# EAGLE schematic BFA_sch (EAGLE 7.6.0)
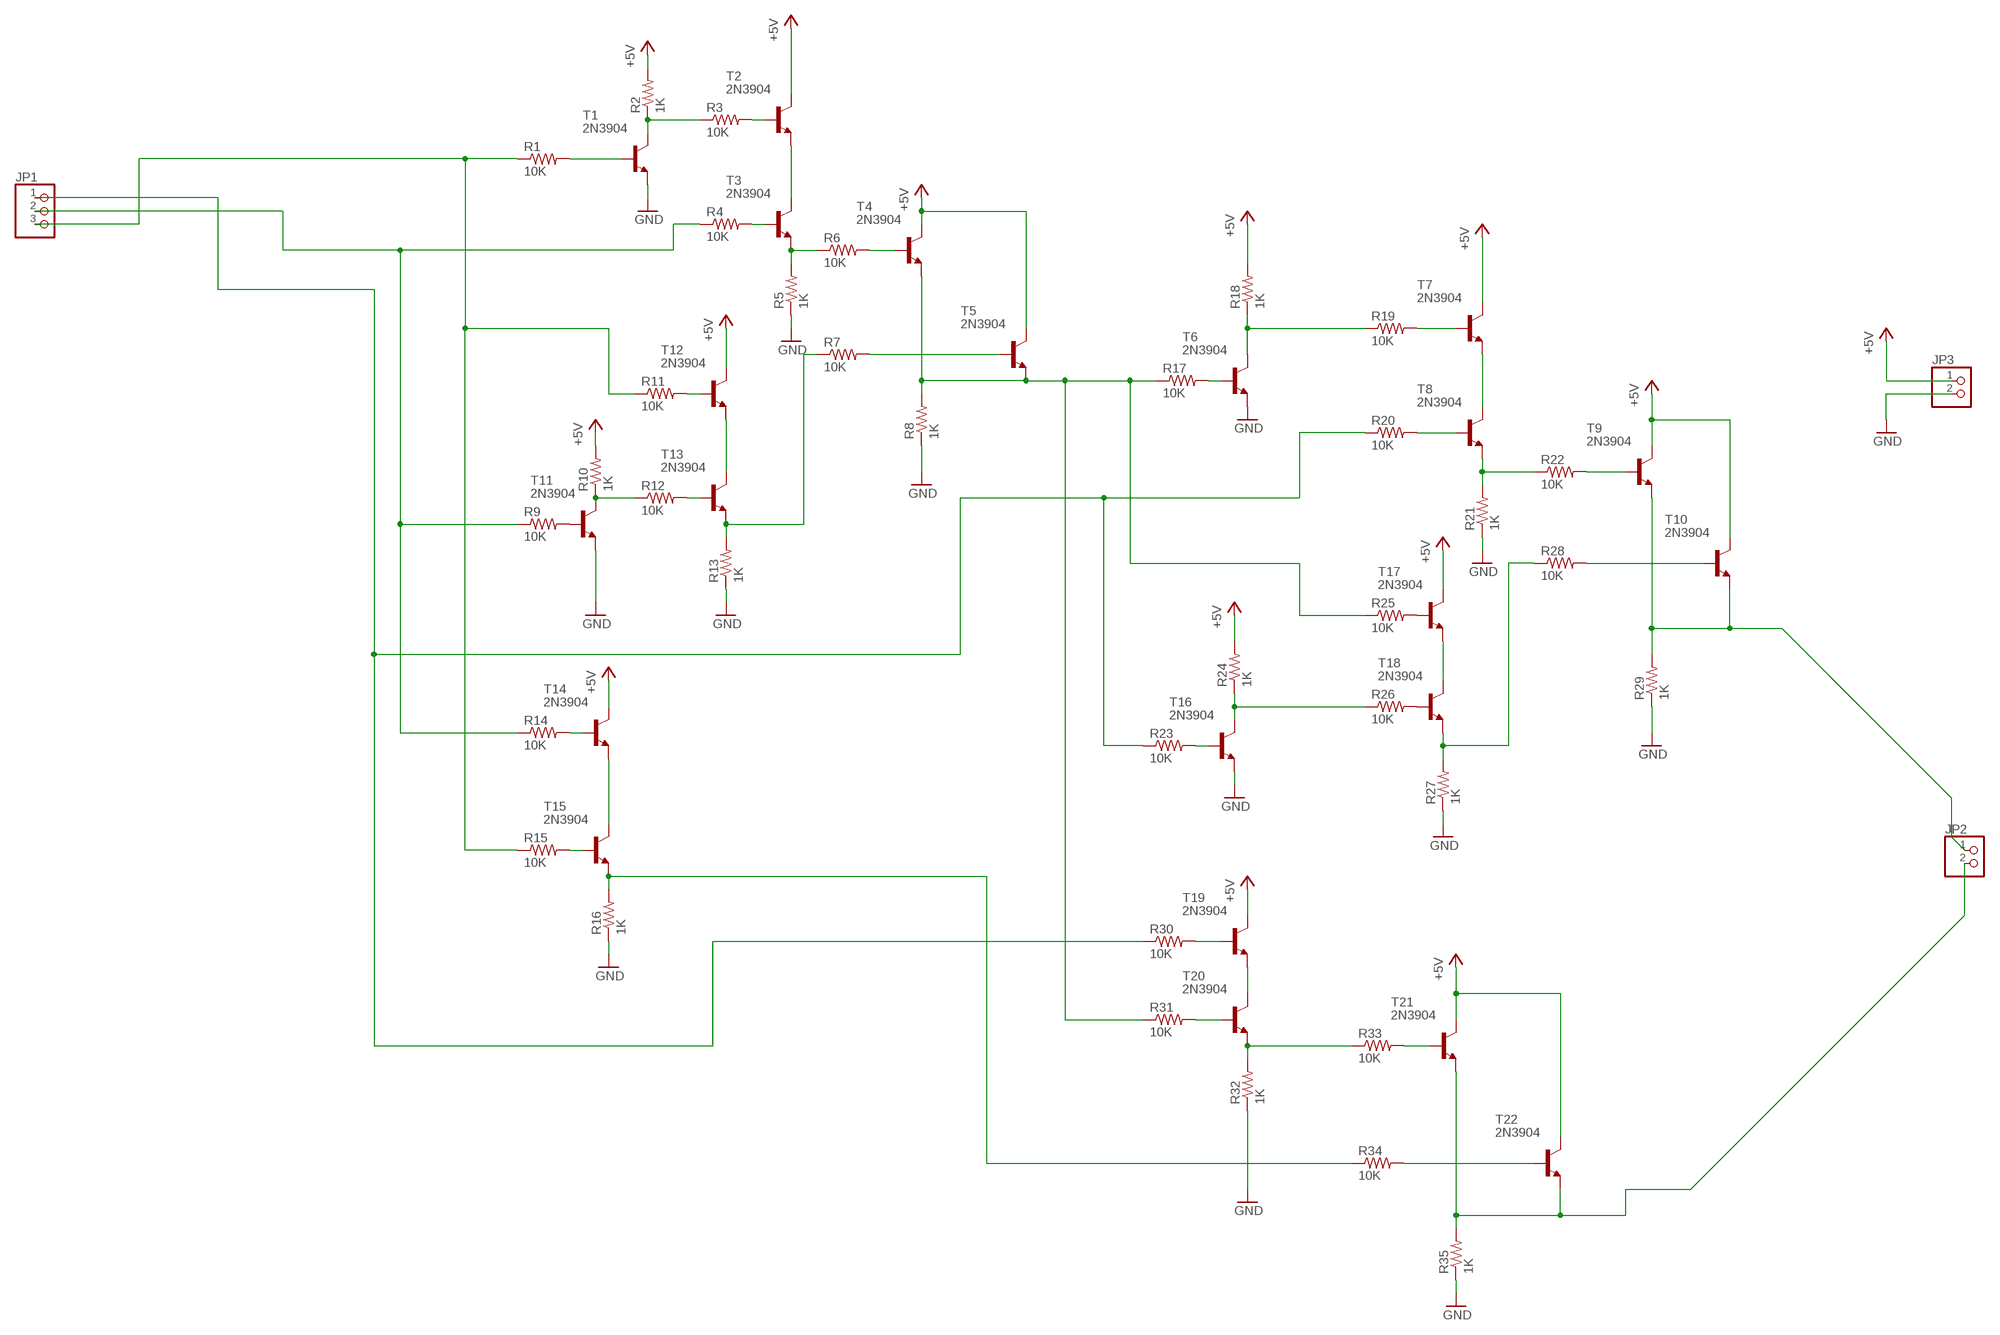
[diagram p0: schematic, sheet 1]

## Parts
JP1  PINHD-1X3/90  [1X03/90]
JP2  PINHD-1X2/90  [1X02/90]
JP3  PINHD-1X2/90  [1X02/90]
R1  10K  R-US_0204/7  [0204/7]
R2  1K  R-US_0204/7  [0204/7]
R3  10K  R-US_0204/7  [0204/7]
R4  10K  R-US_0204/7  [0204/7]
R5  1K  R-US_0204/7  [0204/7]
R6  10K  R-US_0204/7  [0204/7]
R7  10K  R-US_0204/7  [0204/7]
R8  1K  R-US_0204/7  [0204/7]
R9  10K  R-US_0204/7  [0204/7]
R10  1K  R-US_0204/7  [0204/7]
R11  10K  R-US_0204/7  [0204/7]
R12  10K  R-US_0204/7  [0204/7]
R13  1K  R-US_0204/7  [0204/7]
R14  10K  R-US_0204/7  [0204/7]
R15  10K  R-US_0204/7  [0204/7]
R16  1K  R-US_0204/7  [0204/7]
R17  10K  R-US_0204/7  [0204/7]
R18  1K  R-US_0204/7  [0204/7]
R19  10K  R-US_0204/7  [0204/7]
R20  10K  R-US_0204/7  [0204/7]
R21  1K  R-US_0204/7  [0204/7]
R22  10K  R-US_0204/7  [0204/7]
R23  10K  R-US_0204/7  [0204/7]
R24  1K  R-US_0204/7  [0204/7]
R25  10K  R-US_0204/7  [0204/7]
R26  10K  R-US_0204/7  [0204/7]
R27  1K  R-US_0204/7  [0204/7]
R28  10K  R-US_0204/7  [0204/7]
R29  1K  R-US_0204/7  [0204/7]
R30  10K  R-US_0204/7  [0204/7]
R31  10K  R-US_0204/7  [0204/7]
R32  1K  R-US_0204/7  [0204/7]
R33  10K  R-US_0204/7  [0204/7]
R34  10K  R-US_0204/7  [0204/7]
R35  1K  R-US_0204/7  [0204/7]
T1  2N3904  [TO92]
T2  2N3904  [TO92]
T3  2N3904  [TO92]
T4  2N3904  [TO92]
T5  2N3904  [TO92]
T6  2N3904  [TO92]
T7  2N3904  [TO92]
T8  2N3904  [TO92]
T9  2N3904  [TO92]
T10  2N3904  [TO92]
T11  2N3904  [TO92]
T12  2N3904  [TO92]
T13  2N3904  [TO92]
T14  2N3904  [TO92]
T15  2N3904  [TO92]
T16  2N3904  [TO92]
T17  2N3904  [TO92]
T18  2N3904  [TO92]
T19  2N3904  [TO92]
T20  2N3904  [TO92]
T21  2N3904  [TO92]
T22  2N3904  [TO92]

## Nets
+5V: JP3.1 R2.2 R10.2 R18.2 R24.2 T2.1(C) T4.1(C) T5.1(C) T7.1(C) T9.1(C) T10.1(C) T12.1(C) T14.1(C) T17.1(C) T19.1(C) T21.1(C) T22.1(C)
GND: JP3.2 R5.1 R8.1 R13.1 R16.1 R21.1 R27.1 R29.1 R32.1 R35.1 T1.3(E) T6.3(E) T11.3(E) T16.3(E)
N$1: T14.3(E) T15.1(C)
N$2: R9.2 T11.2(B)
N$3: R10.1 R12.1 T11.1(C)
N$4: R5.2 R6.1 T3.3(E)
N$5: T2.3(E) T3.1(C)
N$6: R2.1 R3.1 T1.1(C)
N$7: R19.2 T7.2(B)
N$8: T19.3(E) T20.1(C)
N$9: R32.2 R33.1 T20.3(E)
N$10: JP2.2 R35.2 T21.3(E) T22.3(E)
N$11: R27.2 R28.1 T18.3(E)
N$12: T17.3(E) T18.1(C)
N$13: JP2.1 R29.2 T9.3(E) T10.3(E)
N$14: R21.2 R22.1 T8.3(E)
N$15: T7.3(E) T8.1(C)
N$16: R16.2 R34.1 T15.3(E)
N$17: T12.3(E) T13.1(C)
N$18: R18.1 R19.1 T6.1(C)
N$19: R24.1 R26.1 T16.1(C)
N$20: R7.2 T5.2(B)
N$21: R1.2 T1.2(B)
N$22: JP1.2 R4.1 R9.1 R14.1
N$23: R3.2 T2.2(B)
N$24: R4.2 T3.2(B)
N$25: R6.2 T4.2(B)
N$26: JP1.3 R1.1 R11.1 R15.1
N$27: R11.2 T12.2(B)
N$28: R7.1 R13.2 T13.3(E)
N$29: R8.2 R17.1 R25.1 R31.1 T4.3(E) T5.3(E)
N$30: R25.2 T17.2(B)
N$31: R26.2 T18.2(B)
N$32: R17.2 T6.2(B)
N$33: R15.2 T15.2(B)
N$34: R12.2 T13.2(B)
N$35: R14.2 T14.2(B)
N$36: JP1.1 R20.1 R23.1 R30.1
N$37: R30.2 T19.2(B)
N$38: R31.2 T20.2(B)
N$39: R20.2 T8.2(B)
N$40: R34.2 T22.2(B)
N$41: R23.2 T16.2(B)
N$42: R33.2 T21.2(B)
N$44: R22.2 T9.2(B)
N$45: R28.2 T10.2(B)

## Library data of the parts
JP1 = pinhead:PINHD-1X3: PIN HEADER
JP2 JP3 = pinhead:PINHD-1X2: PIN HEADER
R1-R35 = resistor:R-US_: RESISTOR, American symbol
T1-T22 = transistor:2N3904: NPN TRANSISTOR